# EAGLE board seamonster_buffered3 (EAGLE 9.0.1)
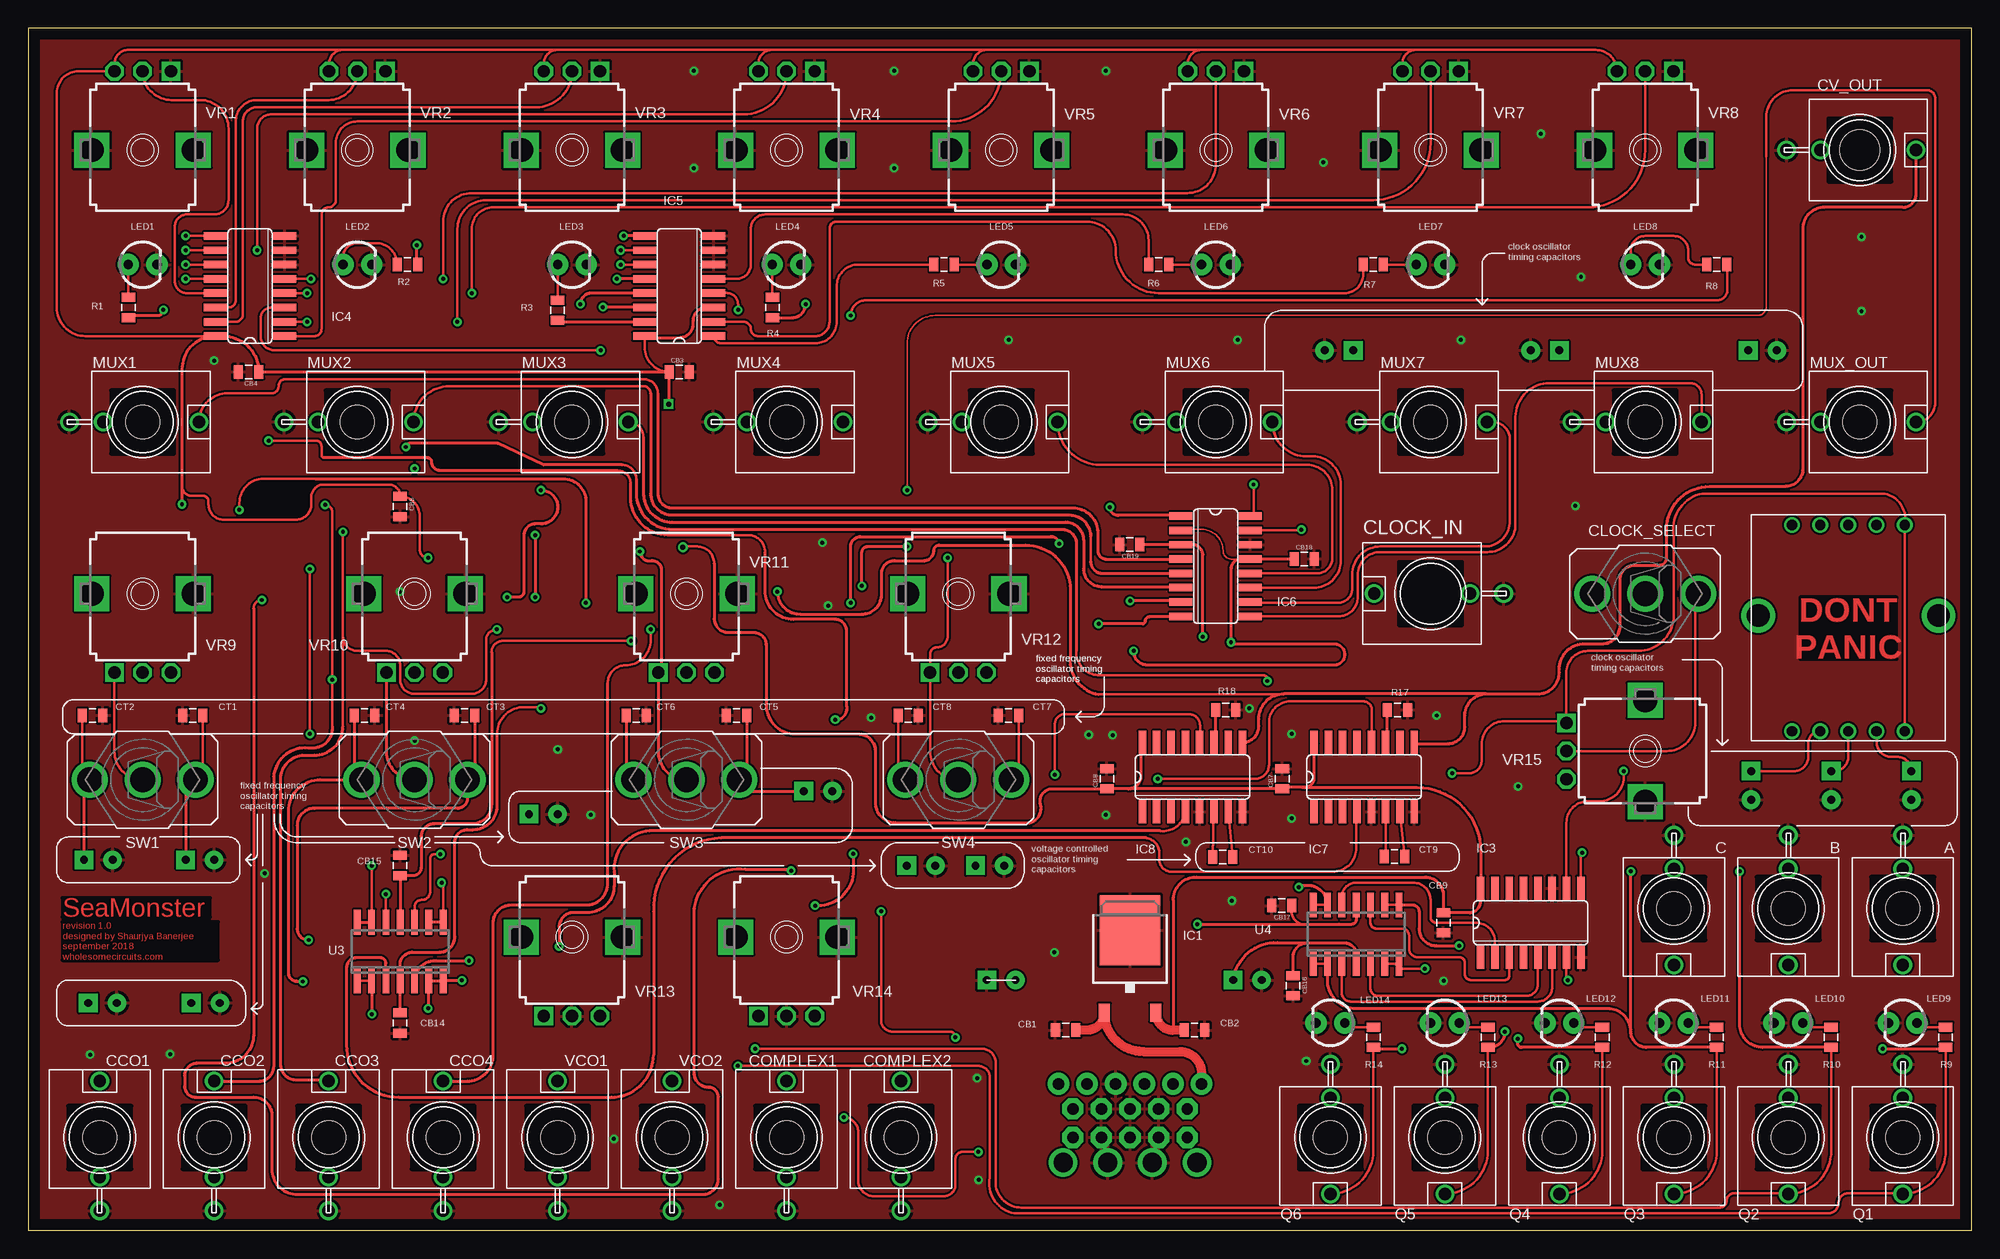
[diagram p5: board, top side]
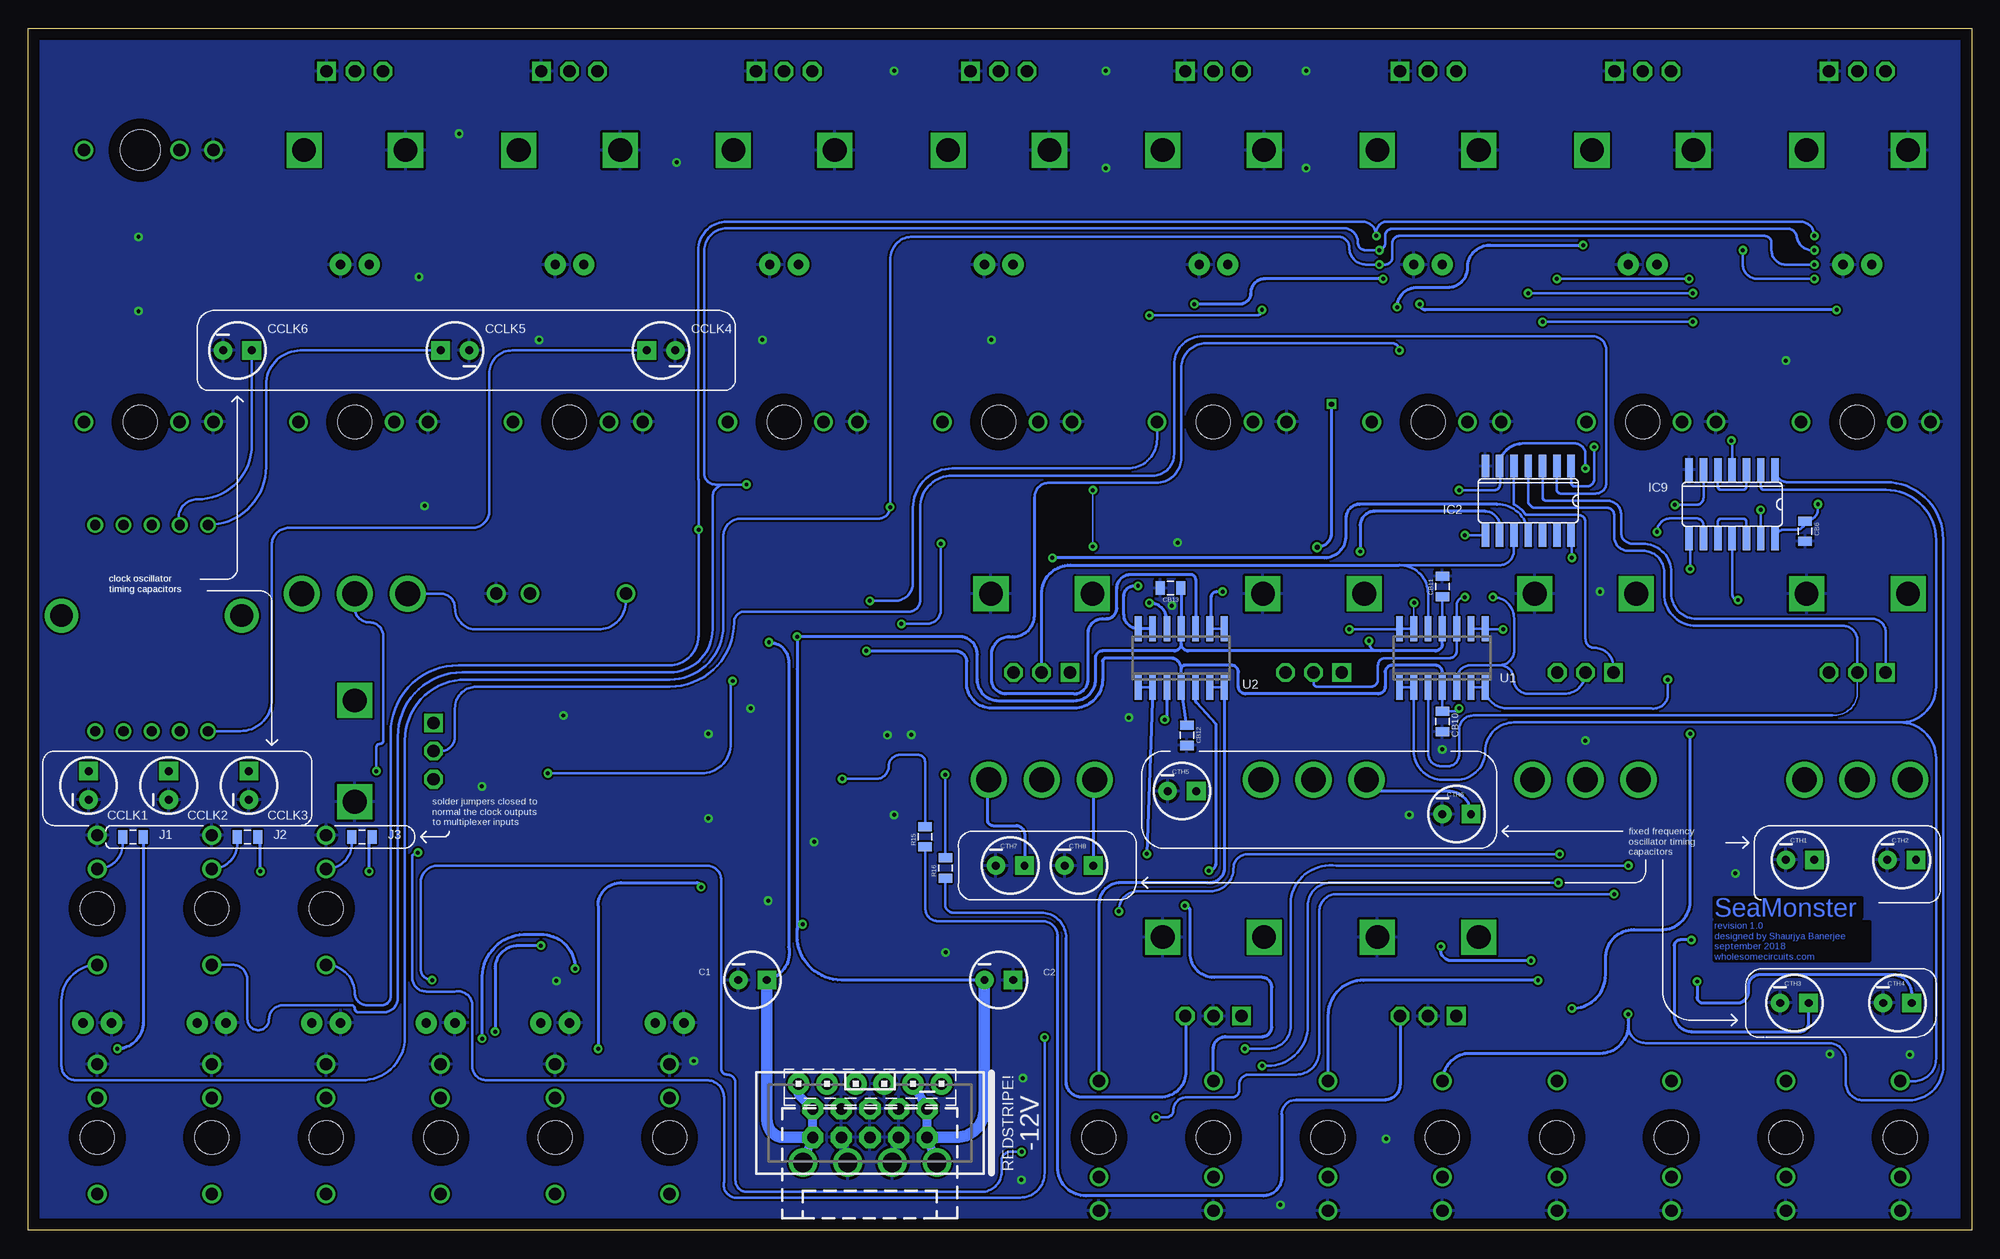
[diagram p6: board, bottom side, seen from below]

Size 172.5 x 106.7 mm. Coordinates in mm from the lower left corner, seen from the top.
Outline: 0,0 172.5,0 172.5,106.7 0,106.7 0,0
Copper layers (1*16): Top 0.035mm / dielectric 1.5mm / Bottom 0.035mm
Design rules "default": minimum track width 6mil, minimum drill 0.35mm, track to track 6mil, track to pad 6mil, pad to pad 6mil, via to via 6mil, smd to smd 6mil, copper to edge 40mil, drill to drill 6mil, minimum pad ring 10mil, minimum via ring 8mil, stop-mask expansion 4mil, vias tented up to drill 0mil, thermal gap 10mil
Holes 3 mm at 6.35,8.26 16.51,8.26 26.67,8.26 36.83,8.26 46.99,8.26 57.15,8.26 67.31,8.26 77.47,8.26 115.57,8.26 125.73,8.26 135.89,8.26 146.05,8.26 156.21,8.26 166.37,8.26 166.37,28.57 156.21,28.57 146.05,28.57 10.16,71.75 29.21,71.75 48.26,71.75 67.31,71.75 86.36,71.75 105.41,71.75 124.46,71.75 143.51,71.75 162.56,71.75
Holes 3.56 mm at 162.56,95.89

## Footprints (pad centres in the part's own frame; a part is rotated, then mirrored left to right if it is on the bottom)
WQP-PJ301M-12_JACK = drill 1.1: P$1_TIP 0,5; P$2_SWITCH 0,-3.5; P$3_SLEEVE 0,-6.5
CPOL-RADIAL-10UF-25V = drill 0.7 pad 1.651 square: 1 1.27,0 | drill 0.7 pad 1.651: 2 -1.27,0
0805 = smd 0.8 x 1.2: 1 -0.9,0; 2 0.9,0
M9040P = drill 2.2: 1 0,4.699 | drill 2.2 pad 3: 2 0,0; 3 0,-4.699
TO252 = smd 1 x 1.6: 1 -2.28,-4.8; 2 2.28,-4.8 | smd 5.4 x 6.2: 3 0,2.5
SO14 = smd 0.66 x 2.032: 1 -3.81,-3.073; 2 -2.54,-3.073; 3 -1.27,-3.073; 4 0,-3.073; 5 1.27,-3.073; 6 2.54,-3.073; 7 3.81,-3.073; 8 3.81,3.073; 9 2.54,3.073; 10 1.27,3.073; 11 0,3.073; 12 -1.27,3.073; 13 -2.54,3.073; 14 -3.81,3.073
SO16 = smd 0.66 x 2.032: 1 -4.445,-3.073; 2 -3.175,-3.073; 3 -1.905,-3.073; 4 -0.635,-3.073; 5 0.635,-3.073; 6 1.905,-3.073; 7 3.175,-3.073; 8 4.445,-3.073; 9 4.445,3.073; 10 3.175,3.073; 11 1.905,3.073; 12 0.635,3.073; 13 -0.635,3.073; 14 -1.905,3.073; 15 -3.175,3.073; 16 -4.445,3.073
LED3MM = drill 0.813 pad 1.88: A -1.27,0; K 1.27,0
SO14' = smd 0.6 x 2.2: 1 -3.81,-2.6; 2 -2.54,-2.6; 3 -1.27,-2.6; 4 0,-2.6; 5 1.27,-2.6; 6 2.54,-2.6; 7 3.81,-2.6; 8 3.81,2.6; 9 2.54,2.6; 10 1.27,2.6; 11 0,2.6; 12 -1.27,2.6; 13 -2.54,2.6; 14 -3.81,2.6
COMBO_POWER = drill 1.016 pad 1.93: +5V-DOTCOM 1.27,-3.493; COM-DOTCOM -1.27,-3.493; KEY-DOTCOM 3.81,-3.493; NA-DOTCOM -6.35,-3.493; V+DOTCOM 6.35,-3.493; V-DOTCOM -3.81,-3.493 | drill 1.016 pad 1.88 octagon: COM-EURO1 -2.54,-1.27; COM-EURO2 -2.54,1.27; COM-EURO3 0,-1.27; COM-EURO4 0,1.27; COM-EURO5 2.54,-1.27; COM-EURO6 2.54,1.27; V+EURO1 5.08,-1.27; V+EURO2 5.08,1.27; V-EURO1 -5.08,-1.27; V-EURO2 -5.08,1.27 | drill 1.7 pad 2.54: COM-MOTM1 1.98,3.493; COM_MOTM2 -1.98,3.493; V+MOTM 5.94,3.493; V-MOTM -5.94,3.493
ALPHA_SR1712F = drill 0.9: 1 5,-9.15; 2 2.5,-9.15; 3 0,-9.15; 4 -2.5,-9.15; 5 -5,-9.15; 6 -5,9.15; 7 -2.5,9.15; 8 0,9.15; 9 2.5,9.15; 10 5,9.15 | drill 2: GND@11 -8,1.1; GND@12 8,1.1
9MM_SNAP-IN_POT = drill 1.1 square: 1 -2.5,-7 | drill 1.1 octagon: 2 0,-7; 3 2.5,-7 | drill 2.1 square: CHASSIS1 -4.5,0; CHASSIS2 4.5,0

## Placement (x,y rotation side)
A  THONKICONNNEW  [WQP-PJ301M-12_JACK]  166.37,28.57 180 top
B  THONKICONNNEW  [WQP-PJ301M-12_JACK]  156.21,28.57 180 top
C  THONKICONNNEW  [WQP-PJ301M-12_JACK]  146.05,28.57 180 top
C1  47µF  [CPOL-RADIAL-10UF-25V]  108.2,22.23 0 bottom
C2  47µF  [CPOL-RADIAL-10UF-25V]  86.36,22.23 0 bottom
CB1  0.1µF  [0805]  92.08,17.78 180 top
CB2  0.1µF  [0805]  103.5,17.78 0 top
CB3  0.1µF  [0805]  57.78,76.2 0 top
CB4  0.1µF  [0805]  19.57,76.21 180 top
CB5  0.1µF  [0805]  33.02,64.26 270 top
CB6  0.1µF  [0805]  14.79,62.05 270 bottom
CB7  0.1µF  [0805]  111.3,40.08 90 top
CB8  0.1µF  [0805]  95.74,40.08 90 top
CB9  0.1µF  [0805]  125.6,27.3 270 top
CB10  0.1µF  [0805]  46.99,45.18 270 bottom
CB11  0.1µF  [0805]  46.99,57.15 90 bottom
CB12  0.1µF  [0805]  69.66,43.94 270 bottom
CB13  0.1µF  [0805]  71.12,57.02 180 bottom
CB14  0.1µF  [0805]  33.02,18.41 270 top
CB15  0.1µF  [0805]  33.02,32.38 90 top
CB16  0.1µF  [0805]  112.27,21.72 270 top
CB17  0.1µF  [0805]  111.25,28.83 180 top
CB18  0.1µF  [0805]  113.25,59.61 0 top
CB19  0.1µF  [0805]  97.76,60.88 180 top
CCLK1  [CPOL-RADIAL-10UF-25V]  167.13,39.5 90 bottom
CCLK2  [CPOL-RADIAL-10UF-25V]  160.02,39.5 90 bottom
CCLK3  [CPOL-RADIAL-10UF-25V]  152.91,39.5 90 bottom
CCLK4  [CPOL-RADIAL-10UF-25V]  116.33,78.11 180 bottom
CCLK5  [CPOL-RADIAL-10UF-25V]  134.62,78.11 180 bottom
CCLK6  [CPOL-RADIAL-10UF-25V]  153.92,78.11 0 bottom
CCO1  THONKICONNNEW  [WQP-PJ301M-12_JACK]  6.35,8.26 0 top
CCO2  THONKICONNNEW  [WQP-PJ301M-12_JACK]  16.51,8.26 0 top
CCO3  THONKICONNNEW  [WQP-PJ301M-12_JACK]  26.67,8.26 0 top
CCO4  THONKICONNNEW  [WQP-PJ301M-12_JACK]  36.83,8.26 0 top
CLOCK_IN  THONKICONNNEW  [WQP-PJ301M-12_JACK]  124.46,56.52 90 top
CLOCK_SELECT  SPDT ON-ON  [M9040P]  143.51,56.52 90 top
COMPLEX1  THONKICONNNEW  [WQP-PJ301M-12_JACK]  67.31,8.26 0 top
COMPLEX2  THONKICONNNEW  [WQP-PJ301M-12_JACK]  77.47,8.26 0 top
CT1  [0805]  14.61,45.72 180 top
CT2  [0805]  5.71,45.72 0 top
CT3  [0805]  38.73,45.72 180 top
CT4  [0805]  29.84,45.72 0 top
CT5  [0805]  62.87,45.72 180 top
CT6  [0805]  53.98,45.72 0 top
CT7  [0805]  87,45.72 180 top
CT8  [0805]  78.11,45.72 0 top
CT9  1µF  [0805]  121.27,33.17 0 top
CT10  1µF  [0805]  106.02,33.16 0 top
CTH1  [CPOL-RADIAL-10UF-25V]  15.24,32.89 0 bottom
CTH2  [CPOL-RADIAL-10UF-25V]  6.22,32.89 0 bottom
CTH3  [CPOL-RADIAL-10UF-25V]  15.75,20.19 0 bottom
CTH4  [CPOL-RADIAL-10UF-25V]  6.6,20.19 0 bottom
CTH5  [CPOL-RADIAL-10UF-25V]  70.1,38.99 0 bottom
CTH6  [CPOL-RADIAL-10UF-25V]  45.72,36.96 0 bottom
CTH7  [CPOL-RADIAL-10UF-25V]  85.34,32.38 0 bottom
CTH8  [CPOL-RADIAL-10UF-25V]  79.25,32.38 0 bottom
CV_OUT  THONKICONNNEW  [WQP-PJ301M-12_JACK]  162.56,95.89 270 top
IC1  7808DT  [TO252]  97.79,24.13 0 top
IC2  40106D  [SO14]  39.37,64.77 180 bottom
IC3  4040D  [SO16]  133.35,27.3 0 top
IC4  4051D  [SO16]  19.68,83.82 90 top
IC5  4051D  [SO16]  57.78,83.82 90 top
IC6  DG408DY  [SO16]  105.38,58.95 270 top
IC7  4046D  [SO16]  118.57,40.24 0 top
IC8  4046D  [SO16]  103.33,40.24 0 top
IC9  4070D  [SO14]  21.27,64.45 180 bottom
J1  [0805]  163.19,34.92 0 bottom
J2  [0805]  153.03,34.92 0 bottom
J3  [0805]  142.88,34.92 0 bottom
LED1  [LED3MM]  10.16,85.72 0 top
LED2  [LED3MM]  29.21,85.72 0 top
LED3  [LED3MM]  48.26,85.72 0 top
LED4  [LED3MM]  67.31,85.72 0 top
LED5  [LED3MM]  86.36,85.72 0 top
LED6  [LED3MM]  105.41,85.72 0 top
LED7  [LED3MM]  124.46,85.72 0 top
LED8  [LED3MM]  143.51,85.72 0 top
LED9  [LED3MM]  166.37,18.41 180 top
LED10  [LED3MM]  156.21,18.41 180 top
LED11  [LED3MM]  146.05,18.41 180 top
LED12  [LED3MM]  135.89,18.41 180 top
LED13  [LED3MM]  125.73,18.41 180 top
LED14  [LED3MM]  115.57,18.41 180 top
MUX1  THONKICONNNEW  [WQP-PJ301M-12_JACK]  10.16,71.75 270 top
MUX2  THONKICONNNEW  [WQP-PJ301M-12_JACK]  29.21,71.75 270 top
MUX3  THONKICONNNEW  [WQP-PJ301M-12_JACK]  48.26,71.75 270 top
MUX4  THONKICONNNEW  [WQP-PJ301M-12_JACK]  67.31,71.75 270 top
MUX5  THONKICONNNEW  [WQP-PJ301M-12_JACK]  86.36,71.75 270 top
MUX6  THONKICONNNEW  [WQP-PJ301M-12_JACK]  105.41,71.75 270 top
MUX7  THONKICONNNEW  [WQP-PJ301M-12_JACK]  124.46,71.75 270 top
MUX8  THONKICONNNEW  [WQP-PJ301M-12_JACK]  143.51,71.75 270 top
MUX_OUT  THONKICONNNEW  [WQP-PJ301M-12_JACK]  162.56,71.75 270 top
Q1  THONKICONNNEW  [WQP-PJ301M-12_JACK]  166.37,8.26 180 top
Q2  THONKICONNNEW  [WQP-PJ301M-12_JACK]  156.21,8.26 180 top
Q3  THONKICONNNEW  [WQP-PJ301M-12_JACK]  146.05,8.26 180 top
Q4  THONKICONNNEW  [WQP-PJ301M-12_JACK]  135.89,8.26 180 top
Q5  THONKICONNNEW  [WQP-PJ301M-12_JACK]  125.73,8.26 180 top
Q6  THONKICONNNEW  [WQP-PJ301M-12_JACK]  115.57,8.26 180 top
R1  270Ω  [0805]  8.89,81.91 90 top
R2  270Ω  [0805]  33.66,85.72 180 top
R3  270Ω  [0805]  46.99,81.66 90 top
R4  270Ω  [0805]  66.04,81.91 90 top
R5  270Ω  [0805]  81.28,85.72 0 top
R6  270Ω  [0805]  100.33,85.72 0 top
R7  270Ω  [0805]  119.38,85.72 0 top
R8  270Ω  [0805]  149.86,85.72 180 top
R9  270Ω  [0805]  170.18,17.15 90 top
R10  270Ω  [0805]  160.02,17.15 90 top
R11  270Ω  [0805]  149.86,17.15 90 top
R12  270Ω  [0805]  139.7,17.15 90 top
R13  270Ω  [0805]  129.54,17.15 90 top
R14  270Ω  [0805]  119.38,17.15 90 top
R15  [0805]  92.91,34.94 90 bottom
R16  [0805]  91.09,32.17 90 bottom
R17  [0805]  121.53,46.21 180 top
R18  [0805]  106.28,46.21 180 top
SW1  SPDT ON-ON  [M9040P]  10.16,40 90 top
SW2  SPDT ON-ON  [M9040P]  34.29,40 90 top
SW3  SPDT ON-ON  [M9040P]  58.42,40 90 top
SW4  SPDT ON-ON  [M9040P]  82.55,40 90 top
U1  TL084  [SO14']  46.99,50.8 0 bottom
U2  TL084  [SO14']  70.17,50.8 0 bottom
U3  TL084  [SO14']  33.02,24.77 0 top
U4  TL084D  [SO14']  117.86,26.29 0 top
U$1  COMBO_POWER  [COMBO_POWER]  97.79,9.53 180 bottom
U$2  CLOCK RATE SELECT  [ALPHA_SR1712F]  161.54,53.47 0 top
VCO1  THONKICONNNEW  [WQP-PJ301M-12_JACK]  46.99,8.26 0 top
VCO2  THONKICONNNEW  [WQP-PJ301M-12_JACK]  57.15,8.26 0 top
VR1  100KΩ  [9MM_SNAP-IN_POT]  10.16,95.89 180 top
VR2  100KΩ  [9MM_SNAP-IN_POT]  29.21,95.89 180 top
VR3  100KΩ  [9MM_SNAP-IN_POT]  48.26,95.89 180 top
VR4  100KΩ  [9MM_SNAP-IN_POT]  67.31,95.89 180 top
VR5  100KΩ  [9MM_SNAP-IN_POT]  86.36,95.89 180 top
VR6  100KΩ  [9MM_SNAP-IN_POT]  105.41,95.89 180 top
VR7  100KΩ  [9MM_SNAP-IN_POT]  124.46,95.89 180 top
VR8  100KΩ  [9MM_SNAP-IN_POT]  143.51,95.89 180 top
VR9  100KΩ  [9MM_SNAP-IN_POT]  10.16,56.52 0 top
VR10  100KΩ  [9MM_SNAP-IN_POT]  34.29,56.52 0 top
VR11  100KΩ  [9MM_SNAP-IN_POT]  58.42,56.52 0 top
VR12  100KΩ  [9MM_SNAP-IN_POT]  82.55,56.52 0 top
VR13  1MΩ  [9MM_SNAP-IN_POT]  48.26,26.03 0 top
VR14  1MΩ  [9MM_SNAP-IN_POT]  67.31,26.03 0 top
VR15  100KΩ  [9MM_SNAP-IN_POT]  143.51,42.55 270 top

## Tracks (layer width: path | path; a pad name or v marks a point on that pad's centre or on a via)
A  (via drill 0.35)
  Top 0.203: IC4.11 v13.97,85.72 | IC5.11 v52.59,85.72 | IC6.1 arc90 102.25,63.45
  Top 0.254: v96,64.2 arc90 96.75,63.45 102.25,63.45
  Bottom 0.203: v13.97,85.72 16.51,85.72 arc90 17.78,87 17.78,87.63 arc-90 18.41,88.27 50.8,88.27 arc-90 51.44,87.63 51.44,86.36 arc90 52.07,85.72 v52.59,85.72 53.77,85.72 arc90 55.25,87.2 arc-90 56.25,88.2 94,88.2 arc-90 96,86.2 v96,64.2 arc90 97.02,63.18 109.22,63.18 arc-90 110.81,61.59 110.81,56.52 110.81,53.66 arc90 115.57,48.89 115.89,48.89 123.51,48.89 133.35,48.89 133.67,48.89 arc-90 139.06,43.5 139.06,34.29 139.06,17.15 arc90 142.88,13.33 168.28,13.33 arc90 169.54,14.6 169.54,20.4 arc90 A.P$1_TIP
B  (via drill 0.35)
  Top 0.203: v13.97,87 IC4.10 | IC5.10 v52.59,87 | IC6.16 arc90 108.75,63.7 v108.75,66.2
  Bottom 0.203: v13.97,87 arc90 15.56,88.27 arc-90 16.51,88.9 51.44,88.9 arc-90 52.07,88.27 52.07,87.63 arc90 52.7,87 v52.59,87 53.79,87 arc90 54.5,87.7 arc-90 55.75,88.95 110.5,88.95 arc-90 112.5,86.95 112.5,67.2 arc-90 111.5,66.2 v108.75,66.2 | v108.75,66.2 108.5,66.2 | B.P$1_TIP 154.38,23.57 arc90 153.03,22.23 153.03,18.73 arc-90 152.08,17.78 arc-90 151.13,18.73 arc90 149.86,20 143.83,20 arc90 143.51,19.69 arc-90 143.19,19.37 140.97,19.37 arc-90 139.7,20.64 139.7,43.81 arc90 133.99,49.53 131,49.53 129.5,49.53 115.57,49.53 arc-90 111.76,53.34 111.76,65.09 arc90 110.64,66.2 v108.75,66.2
C  (via drill 0.35)
  Top 0.203: IC4.9 v13.97,88.27 | v113,62.2 arc-90 112.92,62.13 IC6.15
  Top 0.254: IC5.9 v52.84,88.27
  Bottom 0.203: v13.97,88.27 arc-90 15.24,89.53 52.07,89.53 arc-90 v52.84,88.27 arc-90 54.11,89.53 110.49,89.53 arc-90 113.03,87 113.03,66.67 arc90 113,66.64 v113,62.2 113,52.73 arc90 113.03,52.7 arc90 115.57,50.16 134.3,50.16 arc-90 140.34,44.13 140.34,20.64 arc90 141.29,20 142.24,20 arc90 143.51,20.95 143.51,21.03 arc-90 C.P$1_TIP
CCO1_BUFFERED
  Bottom 0.2: U1.1 U1.2
  Bottom 0.203: U1.2 49.53,42.55 arc-90 46.99,40 45.72,40 arc-90 43.18,42.55 arc90 40.64,45.09 6.35,45.09 | 6.35,45.09 arc-90 3.17,48.26 3.17,61.28 arc-90 7.62,65.72 18.41,65.72 arc90 18.73,66.04 IC9.2 | 6.35,45.09 arc90 3.17,41.91 3.17,15.24 arc90 5.16,13.26 CCO1.P$1_TIP
CCO2_BUFFERED  (via drill 0.35)
  Top 0.203: v26.35,64.41 arc-90 26.99,63.77 v26.99,48.89 26.99,44.72
  Top 0.254: 26.99,44.72 arc-90 25.4,42.81 24.82,42.81 arc90 21.78,40.27 21.78,14.53 arc-90 20.51,13.26 CCO2.P$1_TIP
  Bottom 0.2: U1.6 U1.7
  Bottom 0.203: U1.7 arc-90 41.34,46.35 28.57,46.35 arc-90 26.99,47.31 v26.99,48.89 | IC9.6 23.81,65.04 arc90 24.45,64.41 v26.35,64.41
CCO3_BUFFERED  (via drill 0.35)
  Top 0.203: CCO3.P$1_TIP arc90 26.59,13.33 | 27.94,44.72 27.94,52.7 | 27.94,52.7 v27.94,62 | 27.94,52.7 arc90 29.21,51.43 31.75,51.43 arc-90 33.02,50.16 33.02,48.89 arc90 34.29,47.62 39.37,47.62 arc90 40.64,48.89 40.64,52.39 arc-90 v41.59,53.34
  Top 0.254: 26.59,13.33 23.82,13.33 arc-90 22.41,14.74 22.41,39.77 arc-90 24.32,42.18 25.4,42.18 arc90 27.94,44.72
  Bottom 0.2: U1.8 U1.9
  Bottom 0.203: IC9.9 23.81,62.55 arc-90 24.47,63.2 26.73,63.2 arc-90 v27.94,62 | v41.59,53.34 43.12,53.34 arc90 U1.8
CCO4_BUFFERED  (via drill 0.35)
  Top 0.152: 24,66.7 25.5,66.7
  Top 0.203: 51.44,48.58 arc-90 53.02,50.16 arc90 55.24,52.39 v55.24,53.34 55.24,53.66 | 25.5,66.7 20.88,66.7 arc90 18.75,64.58 v18.75,63.95
  Top 0.254: CCO4.P$1_TIP 38.97,13.26 arc90 41.27,15.56 41.27,27.3 arc-90 42.86,28.89 49.53,28.89 arc90 51.44,30.8 51.44,48.58 | v49.5,55.7 49.5,64.7 arc90 47.5,66.7 25.5,66.7
  Bottom 0.152: v49.5,55.7 arc-90 49.53,55.67 U1.13
  Bottom 0.2: U1.13 U1.14
  Bottom 0.203: U1.14 arc90 50.86,53.34 v55.24,53.34 | v18.75,63.95 18.75,61.4 arc-90 IC9.13
COMPLEX_OUT1_BUFFERED  (via drill 0.35)
  Top 0.254: v69.85,28.83 arc90 73.22,31.69 v73.22,33.42
  Bottom 0.2: U2.1 U2.2
  Bottom 0.254: U2.2 v73.22,33.42 | v69.85,28.83 arc90 69.38,28.35 69.38,24.58 arc-90 67.25,22.45 63,22.45 arc90 62.12,21.58 62.12,18.08 arc90 63,17.2 66.25,17.2 arc-90 67.31,16.15 COMPLEX1.P$1_TIP
COMPLEX_OUT2_BUFFERED
  Bottom 0.2: U2.6 U2.7
  Bottom 0.254: U2.7 66.36,31.94 arc90 67.94,30.86 75.56,30.86 arc-90 77.47,28.96 COMPLEX2.P$1_TIP
CV_OUT  (via drill 0.35)
  Top 0.203: IC4.3 21.59,81.91 arc90 20.64,80.96 20.64,79.38 arc90 21.91,78.11 v50.8,78.11
  Bottom 0.203: 83.19,65.09 arc90 81.92,66.36 72.39,66.36 arc-90 70.17,68.58 70.17,76.52 arc90 67.94,78.74 51.44,78.74 arc90 v50.8,78.11
  Bottom 0.254: 83.19,65.09 83.19,54.61 arc90 85.09,52.7 85.41,52.7 arc-90 87,51.12 87,48.89 arc-90 85.72,47.62 79.69,47.62 arc-90 78.42,48.89 78.42,53.02 arc90 77.15,54.29 76.83,54.29 arc-90 75.88,55.25 75.88,56.97 arc90 74.61,58.24 69.35,58.24 arc90 68.9,57.78 U2.10
CV_OUT_BUFFERED  (via drill 0.35)
  Top 0.203: 95,47.58 111.4,47.58 arc90 111.44,47.62
  Top 0.254: IC8.9 arc90 109.22,44.76 109.22,45.4 arc-90 111.44,47.62 129.42,47.62 | 129.42,47.62 133.99,47.62 arc90 135.89,49.53 135.89,49.85 arc-90 138.11,52.07 139.7,52.07 arc90 141.29,53.66 141.29,57.78 arc-90 142.56,59.05 144.78,59.05 arc90 145.41,59.69 145.41,62.23 arc-90 149.22,66.04 155.96,66.04 arc90 157.5,67.58 157.5,88.92 arc-90 159.38,90.8 166.37,90.8 arc90 167.56,92 CV_OUT.P$1_TIP | IC7.9 arc90 123.13,43.2 126,43.2 arc90 127.5,44.7 127.5,45.7 arc-90 129.42,47.62 | v66.5,56.7 arc90 68.5,54.7 74,54.7 arc90 75.75,56.45 75.75,58.33 arc-90 76.88,59.45 79.5,59.45 arc90 80.38,60.33 arc-90 80.88,60.83 88.5,60.83 arc-90 92.5,56.83 92.5,51.08 arc90 95,47.58
  Bottom 0.2: U2.9 U2.8
  Bottom 0.203: U2.9 arc-90 67.5,53.53 | 67,56.7 v66.5,56.7
  Bottom 0.254: 67.5,53.53 67.5,56.2 arc90 67,56.7
GND  (via drill 0.35)
  Top 0.152: IC8.5
  other vias: 16.5,77.2 125,45.7 71,55.45 20.99,31.7 5.49,15.6 12.6,15.66 102.74,34.48 96.25,43.95 108.38,46.33 74.82,45.52 47,42.7 33,56.7 112.12,44.08 112.12,36.58 34.3,43.47 61.37,2.28 51.97,8.12 70.49,61.04 95.65,36.88 94.13,43.99 84.22,13.51 84.35,4.5 106.83,29.26 125.62,22.15 132.23,39.42 162.71,88.19 162.71,81.59 137.31,64.31 49.93,36.88 87.01,79.05 107.33,79.05 127.15,79.05 137.81,84.64 134.26,97.33 114.95,94.8 95.65,102.92 76.85,94.29 76.85,102.92 59.07,102.92 59.07,94.29 91.08,24.69 113.43,15.04
  pour Top (isolate 0.178): 0,0 172.72,0 172.72,107.31 0,107.31
  pour Bottom (isolate 0.178): 0,0 172.72,0 172.72,107.31 0,107.31
INV_B_IN
  Top 0.203: VR9.1 7.66,42.5 arc90 SW1.2
  Bottom 0.203: VR9.1 arc-90 7.62,49.55 7.62,53.02 arc-90 8.89,54.29 24.45,54.29 arc90 26.67,56.52 26.67,58.42 arc-90 29.21,60.96 30.16,60.96 arc90 31.11,61.91 31.11,63.5 arc-90 32.38,64.77 37.78,64.77 arc90 38.1,65.09 IC2.3
INV_B_OUT
  Bottom 0.152: VR9.2 10.16,47.62 arc90 12.38,45.72
  Bottom 0.203: VR9.2 10.16,52.39 arc-90 11.43,53.66 24.45,53.66 arc90 27.3,56.52 27.3,58.42 arc-90 29.21,60.33 30.48,60.33 arc90 31.75,61.59 31.75,63.5 arc-90 32.38,64.14 38.73,64.14 arc90 39.37,64.77 IC2.4 | 12.38,45.72 40.98,45.72 arc-90 41,45.7 44.25,45.7 arc-90 45.5,44.45 45.5,42.2 arc90 46.5,41.2 47.12,41.2 arc90 48.25,42.33 48.25,43.83 arc-90 48.26,43.84 U1.3
INV_C_IN
  Top 0.254: VR10.1 31.79,42.5 arc90 SW2.2
  Bottom 0.203: 31.75,49.55 arc90 VR10.1 31.79,49.99 arc-90 33.5,51.7 arc90 34.29,52.49 34.29,62.86 arc-90 34.92,63.5 39.58,63.5 39.92,63.91 40.33,64.25 40.64,64.43 IC2.5
INV_C_OUT  (via drill 0.35)
  Top 0.254: v45.5,65.7 arc-90 47,64.2 arc-90 45.5,62.7 45,62.7 arc90 44,61.7 44,56.7 arc-90 43.5,56.2 v42.5,56.2
  Bottom 0.203: VR10.2 arc90 36.18,47.62 39.37,47.62 arc90 40.64,48.89 arc-90 41.91,50.16 | 41.91,50.16 44.45,50.16 arc-90 45.72,48.89 U1.5 | v34.29,67.63 34.29,68.9 arc-90 35.24,69.85 39.9,69.85 | 41.91,50.16 arc-90 40.62,51.45 40.62,52.7 40.62,53.08 40.62,54.33 arc-90 v42.5,56.2 | IC2.6 arc90 41.88,67.81 41.88,66.2 arc90 42.38,65.7 v45.5,65.7
  Bottom 0.254: IC2.6 arc90 39.9,69.85
INV_D_IN  (via drill 0.35)
  Top 0.203: v54.29,60.26 54.29,60.14 | 56.2,49.85 arc90 55.92,49.57 VR11.1
  Top 0.254: VR11.1 55.92,42.5 arc90 SW3.2 | 54.29,60.14 arc90 55.24,59.44 arc-90 56.2,58.74 56.2,49.85
  Bottom 0.203: IC2.9 41.91,62.55 arc-90 43.18,63.82
  Bottom 0.254: 43.18,63.82 53.02,63.82 arc-90 54.29,62.55 v54.29,60.26
INV_D_OUT  (via drill 0.35)
  Top 0.254: v45,61.7 v45,56.2
  Bottom 0.203: VR11.2 58.42,48.58 arc-90 58.1,48.26 53.34,48.26 arc-90 52.7,48.89 52.7,50.16 arc90 52.07,50.8 46.35,50.8 arc-90 45.72,51.43 U1.10 45.72,55.48 arc90 v45,56.2 | IC2.8 arc-90 IC2.8 v45,61.7
INV_E_IN  (via drill 0.35)
  Top 0.203: SW4.2 arc-90 80.05,42.5 VR12.1 80.05,51.16 arc-90 80.64,51.75 arc90 81.6,52.7 v81.6,59.69
  Bottom 0.203: IC2.11 arc-90 42.13,64.45
  Bottom 0.254: 42.13,64.45 54.29,64.45 arc-90 55.56,63.18 55.56,61.59 arc90 57.47,59.69 v81.6,59.69
INV_E_OUT
  Bottom 0.203: U1.12 48.26,56.52 arc-90 50.8,59.05 41.91,59.05 arc-90 40.64,60.33 IC2.10 40.64,61.59
  Bottom 0.254: VR12.2 82.55,56.52 arc90 80.01,59.05 50.8,59.05
MUX1
  Top 0.203: MUX1.P$1_TIP arc-90 17.7,74.3 21.59,74.3 arc90 22.23,74.93 arc-90 22.86,75.56 54.61,75.56 arc-90 55.88,74.3
  Top 0.254: 55.88,74.3 55.88,65.41 arc90 57.15,64.14 92.71,64.14 arc-90 94.93,61.91 94.93,60.33 arc90 95.67,59.59 IC6.4
MUX2
  Top 0.203: MUX2.P$1_TIP arc-90 37.38,74.93 54.61,74.93 arc-90 55.24,74.3 | 94.3,61.59 94.3,59.37
  Top 0.254: 55.24,74.3 55.24,65.41 arc90 57.15,63.5 92.39,63.5 arc-90 94.3,61.59 | 94.3,59.37 arc90 95.35,58.32 IC6.5
MUX3
  Top 0.152: 102.21,57.15 arc-90 IC6.6
  Top 0.203: MUX3.P$1_TIP arc-90 54.61,70.41
  Top 0.254: 54.61,70.41 54.61,65.41 arc90 57.15,62.86 92.08,62.86 arc-90 93.66,61.28 93.66,58.74 arc90 95.25,57.15 102.21,57.15
MUX4  (via drill 0.35)
  Top 0.152: IC6.7 arc90 102.21,55.88
  Top 0.254: 102.21,55.88 v97.79,55.88
  Bottom 0.203: MUX4.P$1_TIP 72.31,70.25 arc90 74.93,67.63 90.49,67.63 arc-90 93.98,64.14 93.98,57.47 arc90 95.57,55.88 v97.79,55.88
MUX5
  Top 0.203: MUX5.P$1_TIP arc90 95.16,67.95 108,67.95 111,67.95 113.5,67.95 arc-90 115.75,65.7 115.75,59.7 arc-90 114.36,58.32 IC6.12
MUX6
  Top 0.203: MUX6.P$1_TIP arc90 113.46,68.7 114,68.7 arc-90 116.5,66.2 116.5,59.45 arc-90 114.09,57.05 IC6.11
MUX7
  Top 0.203: IC6.10 arc90 108.53,55.7 116.25,55.7 arc90 117.5,56.95 117.5,58.2 arc-90 120,60.7 120.5,60.7 129.25,60.7 arc90 131.5,62.95 131.5,70.2 arc90 129.95,71.75 MUX7.P$1_TIP
MUX8
  Top 0.203: IC6.9 116.31,54.51 arc90 118,56.2 118,58.2 arc-90 120,60.2 129.5,60.2 arc90 132,62.7 132,72.2 arc-90 135,75.2 147.5,75.2 arc-90 148.51,74.19 MUX8.P$1_TIP
N$1  (via drill 0.35)
  Top 0.203: IC6.8 arc-90 102.25,54.45 | v95,53.83 95,53.7
  Top 0.254: v73,55.7 73,60.7 arc-90 73.88,61.58 90.75,61.58 arc-90 v91.5,60.95 | v95,53.83 98.88,53.83 arc90 99.12,54.08 arc-90 99.5,54.45 102.25,54.45
  Bottom 0.203: v91.5,60.95 91.5,55.08 arc90 92.75,53.83 v95,53.83
  Bottom 0.254: U2.12 71.44,54.14 arc-90 v73,55.7
N$2  (via drill 0.35, 0.35 pad 0.75)
  Top 0.203: U$2.1 U$2.10 arc90 164.77,65.41 148.59,65.41 arc90 146.05,61.59 146.05,54.61 arc-90 142.88,51.43 138.43,51.43 arc90 136.51,49.52 VR15.1 arc90 136.35,45.2 131,45.2 arc90 129,43.2 129,41.7 arc-90 127.88,40.58 v126.38,40.58 | 52.7,67.94 arc-90 53.98,66.67 | 93.03,51.43 arc90 94.93,49.28 arc90 94.94,49.28 109.6,49.28 arc-90 109.98,48.89 v109.98,48.77 | v33.52,69.53 arc-90 33.84,69.85
  Top 0.254: 52.7,67.94 45.72,67.94 41.66,69.85 33.84,69.85 | 53.98,66.67 53.98,65.41 arc90 57.15,62.23 91.76,62.23 arc-90 93.03,60.96 93.03,51.43
  Bottom 0.203: IC2.1 35.56,66.36 arc-90 35.24,66.04 34.16,66.04 arc-90 33.52,66.67 v33.52,69.53 | v126.38,40.58 112.75,40.58 arc-90 110.12,43.2 110.12,48.62 arc90 v109.98,48.77
N$3
  Top 0.203: U$2.2 164.04,43.35 arc90 165.35,42.04 165.86,42.04 arc-90 CCLK1.1
N$4
  Top 0.203: U$2.3 161.54,42.04 arc-90 160.27,40.77 CCLK2.1
N$5
  Top 0.203: 159,44.28 arc-90 U$2.4 arc90 157.99,43.26 157.99,42.04 arc-90 156.72,40.77 CCLK3.1
N$6
  Top 0.203: U$2.5 arc90 156.46,44.24
  Bottom 0.203: CCLK4.1 129.54,78.11 arc-90 131.57,76.07 131.57,63.88 arc90 133.1,62.36 149.35,62.36 arc-90 150.88,60.83 150.88,47.12 arc90 153.68,44.32 U$2.5
N$7
  Bottom 0.203: CCLK5.1 148.34,78.11 arc-90 151.38,75.06 151.38,67.78 arc90 U$2.6
N$8
  Bottom 0.203: U$2.7 arc111 157.48,64.9 arc-90 152.65,69.72 CCLK6.1
N$9  (via drill 0.35)
  Top 0.152: 154.25,95.33 154.25,81.95 arc-90 153.5,81.2 80.5,81.2 arc90 78,78.7 v78,65.7
  Top 0.203: MUX_OUT.P$1_TIP arc90 169.25,73.44 169.25,100.45 arc90 168.5,101.2 156.62,101.2 arc90 154.25,98.83 154.25,95.33
  Top 0.254: v74,57.2 74,60.2 arc-90 74.5,60.7 v78,60.7
  Bottom 0.152: v78,60.7 78,65.45 arc-90 78.12,65.58 arc90 v78,65.7 | 74.38,57.2 v74,57.2
  Bottom 0.254: U2.13 U2.14 arc90 75.25,54.67 75.25,56.33 arc90 74.38,57.2
N$10
  Top 0.2: R1.2 LED1.A
N$11
  Top 0.203: LED2.A 27.94,86.36 arc-90 29.21,87.63 30.85,87.63 arc-90 R2.2
N$12
  Top 0.2: R3.2 LED3.A
N$13
  Top 0.2: R4.2 LED4.A
N$14
  Top 0.2: LED5.A R5.2
N$15
  Top 0.2: LED6.A R6.2
N$16
  Top 0.2: LED7.A R7.2
N$17
  Top 0.2: LED8.A 142.24,87 arc-90 143.51,88.27 146.05,88.27 arc-90 147.32,87 147.32,86.36 arc90 147.96,85.72 R8.2
N$18
  Top 0.203: VR1.2 arc90 12.71,100.33 15.24,100.33 arc-90 17.78,97.79 17.78,91.44 arc-90 16.51,90.17 13.97,90.17 arc90 13.02,88.9 13.02,84.45 arc90 13.97,83.19 IC4.13
N$19  (via drill 0.35)
  Top 0.254: R1.1 arc-90 9.08,81.2 11.5,81.2 arc90 v12,81.7 | IC5.13 49.98,83.19 arc90 v49,82.2
  Bottom 0.254: v49,82.2 arc-90 48.5,81.7 v12,81.7
N$20  (via drill 0.35)
  Top 0.254: R2.1 arc-90 34.5,85.78 v34.5,87.45 | IC5.14 arc90 54.67,81.95 v51,81.95
  Bottom 0.254: v51,81.95 arc90 49.25,83.7 46.5,83.7 arc-90 44.75,85.45 arc90 42.75,87.45 v34.5,87.45
N$21
  Top 0.254: R3.1 arc90 47.11,80.64 IC5.15
N$22  (via drill 0.35)
  Top 0.254: R4.1 67.81,81.02 arc90 v69,82.2 | IC5.12 v52.25,84.45
  Bottom 0.254: v52.25,84.45 62.75,84.45 arc-90 64,83.2 arc90 65,82.2 v69,82.2
N$23
  Top 0.203: R5.1 73.66,85.72 arc90 71.75,83.82 71.75,83.19 71.75,80.64 arc-90 69.85,78.74 61.49,78.74 arc-90 IC5.1
N$24
  Top 0.203: IC5.5 62.87,84.45 arc90 64.14,85.72 64.14,88.9 arc-90 65.41,90.17 97.16,90.17 arc-90 99.43,87.89 R6.1
N$25
  Top 0.203: R7.1 118.48,84.83 arc-90 116.84,83.19 100.33,83.19 arc-90 96.52,87 arc90 93.98,89.53 71.75,89.53 arc90 71.12,88.9 71.12,80.64 arc-90 69.85,79.38 64.77,79.38 arc-90 64.14,80.01 arc90 63.5,80.64 IC5.2
N$26  (via drill 0.35)
  Top 0.152: R8.1 arc-90 150.81,85.67
  Top 0.203: 150.81,85.67 150.81,83.5 arc-90 149.86,82.55 74.61,82.55 74.34,82.55 arc90 v73,81.2 | IC5.4 arc-90 60.88,83.2 62,83.2 arc-90 63,82.2 v63,81.7
  Bottom 0.203: v63,81.7 arc90 63.5,81.2 v73,81.2
N$27
  Top 0.203: VR2.2 arc-90 26.66,100.33 20.32,100.33 arc90 18.41,98.42 18.41,82.55 arc-90 17.78,81.91 IC4.14
N$28
  Top 0.203: VR3.2 arc-90 45.07,99.69 20.32,99.69 arc90 19.05,98.42 19.05,81.28 arc-90 18.41,80.64 IC4.15
N$29  (via drill 0.35)
  Top 0.203: VR4.2 arc-90 63.48,99.06 21.59,99.06 arc90 20.32,97.79 v20.32,87 | IC4.12 v13.97,84.45
  Bottom 0.203: v13.97,84.45 19.05,84.45 arc90 20.32,85.72 v20.32,87
N$30
  Top 0.203: VR5.2 arc-90 81.9,98.42 29.21,98.42 arc90 27.3,96.52 27.3,91.44 arc-90 26.67,90.8 arc90 26.04,90.17 26.04,80.01 arc-90 25.4,79.38 IC4.1
N$31  (via drill 0.35)
  Top 0.203: VR6.2 105.41,94.61 arc-90 102.87,92.08 39.37,92.08 arc90 36.83,89.53 v36.83,84.45 | IC4.5 v25.08,84.45
  Bottom 0.203: v36.83,84.45 v25.08,84.45
N$32  (via drill 0.35)
  Top 0.203: VR7.2 124.46,96.52 arc-90 119.38,91.44 40.64,91.44 arc90 38.1,88.9 v38.1,80.64 | IC4.2 v24.77,80.64
  Bottom 0.203: v38.1,80.64 v24.77,80.64
N$33  (via drill 0.35)
  Top 0.203: VR8.2 143.51,95.89 arc-90 138.43,90.8 41.27,90.8 arc90 39.37,88.9 v39.37,83.19 | IC4.4 v24.77,83.19
  Bottom 0.203: v24.77,83.19 v39.37,83.19
N$34
  Bottom 0.203: J1.1 164.09,34.35 arc90 A.P$2_SWITCH
N$35
  Bottom 0.203: IC9.5 22.54,66.04 arc-90 22.23,65.72 20.32,65.72 arc-90 20,66.04 IC9.3
N$36
  Bottom 0.203: IC9.10 22.54,62.86 arc90 22.23,63.18 20.32,63.18 arc90 20,62.86 IC9.12
N$37
  Bottom 0.203: J2.1 153.94,34.35 arc90 B.P$2_SWITCH
N$38  (via drill 0.35)
  Top 0.203: v71.63,45.34 71.88,45.34 | 65.41,60.2 arc90 63.88,61.72 56.77,61.72 | 53.47,66.29 arc90 52.32,67.44 | 26.29,68.58 arc-90 26.04,68.83 26.04,69.6 arc90 25.53,70.1 v21.34,70.1
  Top 0.254: 71.88,45.34 arc90 72.64,46.61 72.64,53.21 arc90 71.63,54.23 67.94,54.23 arc-90 65.41,56.77 65.41,60.2 | 56.77,61.72 arc-90 53.47,65.02 53.47,66.29 | 52.32,67.44 36.58,67.44 arc-90 35.81,68.2 arc90 35.43,68.58 26.29,68.58
  Bottom 0.203: 71.44,45.53 arc90 v71.63,45.34 | v21.34,70.1 arc90 21.27,70.04 IC9.4
  Bottom 0.254: U2.3 71.44,45.53
N$39  (via drill 0.35)
  Top 0.203: v20.75,55.95 arc90 20,55.2
  Top 0.254: 20,55.2 20,17.33 arc-90 17.5,14.83 15,14.83 arc90 13.88,13.71 13.88,12.83 arc90 14.88,11.83 20,11.83 arc-90 21.62,10.21 21.62,5.46 arc90 23.88,3.21 59.88,3.21 arc90 61.25,4.58 61.25,11.83 arc90 60.38,12.71 arc-90 59.12,13.96 59.12,28.58 arc-90 63.62,32.06 67.58,32.06 arc-90 v67.72,31.93
  Bottom 0.203: U2.5 arc90 68.88,48.18 | IC9.11 arc90 21.25,61.36 21.25,56.45 arc-90 v20.75,55.95
  Bottom 0.254: 68.88,48.18 arc-44 68.83,46.86 67.11,44.95 67.11,32.54 arc90 v67.72,31.93
N$40  (via drill 0.35)
  Top 0.203: IC7.12 arc90 119.25,43.36 119.25,46.2 arc90 118.5,46.95 112,46.95 arc90 110.12,45.08 110.12,41.33 arc-90 108.88,40.08 v100.25,40.08
  Bottom 0.203: v100.25,40.08 97.25,40.08 arc-90 96.12,41.2 arc90 95.12,42.2 93.5,42.2 arc90 92.91,41.61 R15.2
N$42
  Bottom 0.203: VR13.3 arc90 VR13.3 | 60,11.58 arc-90 61.25,10.33 | 81.12,26.08 arc-90 82.5,27.45 91.75,27.45 arc90 92.88,28.58 92.88,29.2 | 92.88,29.2 92.88,29.45 | 92.88,29.2 arc90 92.91,29.23 R15.1
  Bottom 0.254: VR13.3 50.75,12.96 arc90 52.12,11.58 60,11.58 | 61.25,10.33 61.25,4.71 arc90 62.88,3.08 78.62,3.08 arc90 81.12,5.58 81.12,26.08
N$43
  Top 0.203: CLOCK_SELECT.3 arc90 147.96,56.26 147.96,45.09 arc-90 145.41,42.55 VR15.2
  Bottom 0.203: VR15.2 135.89,42.55 arc-90 134.62,43.81 134.62,46.35 arc90 132.72,48.26 115.57,48.26 arc-90 109.86,53.97 arc90 108.9,54.93 94.3,54.93 arc-90 93.34,55.88 93.34,64.14 arc90 90.49,66.99 72.71,66.99 arc-90 70.8,68.9 70.8,76.83 arc90 68.26,79.38 33.7,79.38 arc90 32.43,78.11 32.43,66.36 arc90 33.38,65.41 36.51,65.41 arc90 36.83,65.72 IC2.2
N$44
  Top 0.203: IC7.6 120.47,33.28 arc-90 CT9.1
N$45
  Top 0.203: IC7.7 CT9.2
N$47
  Top 0.203: CT2.1 4.82,40.65 arc90 SW1.1
  Top 0.254: SW1.1 arc90 4.95,39.5 CTH2.1
N$48
  Top 0.203: IC8.6 CT10.1
N$49
  Top 0.203: IC8.7 CT10.2
N$50  (via drill 0.35)
  Top 0.203: IC3.10 136.53,36.2 arc-90 138.43,38.1 139.06,38.1 arc90 141.6,40 v141.6,40.77
  Bottom 0.203: CLOCK_SELECT.2 143.51,55.25 arc-90 142.24,53.97 arc90 140.97,52.7 140.97,43.5 arc90 141.29,43.18 arc-90 141.6,42.86 v141.6,40.77
N$51
  Top 0.203: LED9.A arc90 168.01,18.05 R9.2
N$52
  Top 0.203: CT1.1 15.51,40.65 arc-90 SW1.3
  Top 0.254: SW1.3 arc90 13.97,39.12 CTH1.1
N$55  (via drill 0.35)
  Top 0.254: CT4.1 28.95,40.65 arc90 SW2.1 25.91,40 arc90 23.11,37.21 23.11,22.86 arc90 23.88,22.1 v24.38,22.1
  Bottom 0.254: v24.38,22.1 24.38,20.7 arc-90 23.88,20.19 20.83,20.19 arc-90 19.81,21.21 19.81,21.72 arc90 18.8,22.73 7.11,22.73 arc90 5.33,20.95 CTH4.1
N$56  (via drill 0.35)
  Top 0.254: CT3.1 39.63,40.65 SW2.3 38.99,38.35 arc-90 38.1,37.46 25.4,37.46 arc90 23.88,35.94 23.88,26.8 arc90 v24.89,25.78
  Bottom 0.254: v24.89,25.78 25.91,25.78 arc-90 26.42,25.27 26.42,19.18 arc-90 24.89,17.65 15.24,17.65 arc-90 14.48,18.41 CTH3.1
N$59
  Top 0.254: CT6.1 53.08,40.65 arc90 SW3.1
  Bottom 0.254: CTH6.1 arc-90 46.48,38.99 52.7,38.99 arc90 SW3.1
N$60
  Top 0.254: CT5.1 63.77,40.65 arc-90 SW3.3 arc90 64.14,38.99 CTH5.1
N$61  (via drill 0.35)
  Top 0.203: U3.10 34.29,28.7 arc-90 34.92,29.34 arc90 35.69,30.1 35.69,33.02 arc-90 36.07,33.4 v36.58,33.4 | v75.69,28.32 75.69,18.67 arc90 76.71,17.65 81.79,17.65 arc-90 v82.3,17.15 | IC3.9 137.79,33.4 arc-90 v137.92,33.53
  Bottom 0.203: v75.69,28.32 75.69,28.45 arc90 74.04,30.1 67.56,30.1 arc-90 65.53,32.13 arc90 64.26,33.4 v36.58,33.4 | v82.3,17.15 82.3,5.08 arc90 84.45,2.92 109.86,2.92 arc90 110.74,4.32 110.74,11.81 arc-90 112.27,13.33 131.83,13.33 arc90 133.1,14.6 133.1,20.19 arc-90 134.62,21.21 137.16,21.21 arc90 138.43,22.48 138.43,33.15 arc90 138.18,33.4 138.05,33.4 arc-90 v137.92,33.53
N$63
  Top 0.203: CT8.1 77.2,40.65 arc90 SW4.1
  Bottom 0.203: SW4.1 arc-90 77.98,39.88
  Bottom 0.254: 77.98,39.88 CTH8.1
N$64
  Top 0.203: CT7.1 87.89,40.65 arc-90 SW4.3
  Bottom 0.203: SW4.3 arc-90 87.38,39.88
  Bottom 0.254: 87.38,39.88 87.38,36.45 arc-90 86.87,35.94 84.84,35.94 arc90 84.07,35.18 CTH7.1
N$65
  Top 0.203: LED10.A arc90 157.85,18.05 R10.2
N$66
  Top 0.203: LED11.A arc90 147.69,18.05 R11.2
N$67
  Top 0.203: LED12.A arc90 137.53,18.05 R12.2
N$68
  Top 0.203: LED13.A arc90 127.37,18.05 R13.2
N$69
  Top 0.203: LED14.A arc90 117.21,18.05 R14.2
N$70
  Bottom 0.203: CLOCK_IN.P$1_TIP 119.46,55.8 arc90 121.92,53.34 132.72,53.34 arc90 134.62,55.25 arc-90 135.89,56.52 CLOCK_SELECT.1
N$71  (via drill 0.35)
  Top 0.203: IC8.12 arc90 104,43.35 104,44.83 arc90 103,45.83 92,45.83 arc90 91.12,44.95 v91.12,40.45
  Bottom 0.203: v91.12,40.45 arc90 91.09,40.42 R16.2
N$72
  Top 0.203: 69.83,19.05 arc90 VR14.3
  Bottom 0.203: VR14.3 arc90 69.75,18.98 | 80.38,25.95 arc-90 82.62,28.2 90.38,28.2 arc90 91.12,28.95 91.12,31.24 arc90 R16.1
  Bottom 0.254: 69.75,18.98 69.75,14.08 arc90 72,11.83 79,11.83 arc90 80.38,13.21 80.38,25.95
N$74
  Top 0.254: IC8.11 arc90 105.39,43.47 R18.2
N$75
  Top 0.254: IC7.11 arc90 120.62,43.47 R17.2
N$76
  Bottom 0.203: J3.1 143.78,34.35 arc90 C.P$2_SWITCH
Q1BUFFERED  (via drill 0.35)
  Top 0.203: R9.1 170.18,16.13 170.18,7.06 arc-90 Q1.P$1_TIP arc90 166.32,3.3 161.54,3.3 arc90 160.66,2.41 arc-90 159.77,1.52 87.5,1.52 arc-90 85.34,4.7 85.34,13.59 arc90 84.33,14.6 v62.99,14.6 | 36.83,29.46 U3.8 36.83,30.73 arc90 v36.7,30.86
  Top 0.254: U3.8 U3.9 | v164.59,16.13 170.18,16.13
  Bottom 0.203: v36.7,30.86 56.9,30.86 arc-90 58.93,28.83 58.93,18.16 arc90 62.48,14.6 v62.99,14.6
  Bottom 0.254: J1.2 162.29,18.43 arc90 v164.59,16.13 164.08,16.13
Q2  (via drill 0.35)
  Top 0.203: U3.12 v31.75,29.84 | IC3.7 136.53,22.35 arc90 v136.65,22.23 | v72.39,10.03 arc-90 73.66,8.76 73.66,4.45 arc90 75.06,3.05 81.28,3.05 arc90 82.3,4.06 82.3,6.35 arc-90 82.93,6.99 v84.33,6.99
  Bottom 0.203: v31.75,29.84 56.39,29.84 arc-90 57.91,28.32 57.91,15.88 arc90 59.94,13.84 64.14,13.84 arc-90 65.02,12.95 65.02,12.45 arc90 65.66,11.81 69.72,11.81 arc-90 70.87,10.67 arc90 71.5,10.03 v72.39,10.03 | v136.65,22.23 arc90 137.67,23.24 137.67,30.86 arc90 136.14,32.38 112.27,32.38 arc90 111,31.11 111,14.35 arc-90 110.49,13.84 arc90 109.73,13.08 109.73,4.45 arc-90 108.71,3.43 87.88,3.43 arc-90 86.11,5.21 86.11,6.22 arc90 85.34,6.99 v84.33,6.99
Q2BUFFERED  (via drill 0.35)
  Top 0.203: R10.1 160.02,7.06 arc-90 Q2.P$1_TIP arc90 156.16,3.3 151.38,3.3 arc90 150.75,2.67 arc-90 150.11,2.03 88.14,2.03 arc-90 85.85,4.32 85.85,14.6 arc90 84.84,16.13 v64.52,16.13 | U3.13 v30.48,32.38
  Top 0.254: U3.14 U3.13 | R10.1 arc90 160.01,16.26 153.92,16.26 arc-90 151.89,18.29 v151.89,31.88
  Bottom 0.203: v30.48,32.38 56.39,32.38 arc-90 60.45,29.34 60.45,18.16 arc90 62.48,16.13 v64.52,16.13
  Bottom 0.254: v151.89,31.88 151.89,34.68 arc-90 J2.2
Q3
  Top 0.203: IC3.6 135.25,21.59 arc-90 133.99,20.32 117.35,20.32 arc-90 116.59,21.08 U4.3
Q3BUFFERED  (via drill 0.35)
  Top 0.203: U4.2 U4.1 | Q3.P$1_TIP arc90 149.86,7.06 R11.1
  Top 0.254: 142.24,17.65 v142.24,31.88 | 142.24,17.65 arc90 140.21,19.69 117.86,19.69 arc-90 115.32,22.23 U4.2 | 142.24,17.65 arc90 143.65,16.24 R11.1
  Bottom 0.254: v142.24,31.88 142.24,34.66 arc90 J3.2
Q4
  Top 0.203: IC3.5 133.99,21.84 arc-90 132.97,20.83 119.76,20.83 arc-90 119.13,21.46 U4.5
Q4BUFFERED  (via drill 0.35)
  Top 0.203: U4.7 121.41,23.69 | 121.41,23.69 U4.6 | Q4.P$1_TIP arc90 139.7,7.06 R12.1 | v123.95,23.24 121.86,23.24 arc-90 121.41,23.69
  Top 0.254: R12.1 132.6,16.24 arc-90 132.21,16.51 v132.21,17.02
  Bottom 0.254: v132.21,17.02 132.21,22.23 arc90 128.52,26.29 127,26.29 arc90 v123.95,23.24
Q5
  Top 0.203: U4.10 119.13,27.3 arc90 119.63,26.8 121.92,26.8 arc-90 122.56,26.16 122.56,25.02 arc90 123.32,24.26 127,24.26 arc-90 127.51,23.75 127.51,22.73 arc90 128.02,22.23 131.06,22.23 arc90 131.44,22.61 IC3.3 arc-90 131.57,24.1
Q5BUFFERED  (via drill 0.35)
  Top 0.203: U4.9 U4.8 | Q5.P$1_TIP arc90 129.54,7.06 R13.1
  Top 0.254: U4.8 122.88,28.89 arc-90 123.44,28.32 123.44,26.8 arc90 124.97,25.27 v127,25.27 | v131.06,17.65 arc-90 129.66,16.24 R13.1
  Bottom 0.254: v127,25.27 129.03,25.27 arc-90 131.06,23.24 v131.06,17.65
Q6
  Top 0.203: IC3.2 130.18,25.65 arc90 128.52,27.3 124.97,27.3 arc-90 124.46,27.81 124.46,29.34 arc90 122.94,30.86 117.86,30.86 arc90 116.59,29.59 U4.12
Q6BUFFERED  (via drill 0.35)
  Top 0.203: U4.14 U4.13 | Q6.P$1_TIP arc90 119.38,7.06 R14.1
  Top 0.254: R14.1 arc90 119.5,16.13 v121.92,16.13 | U4.13 arc90 113.6,30.61 112.9,30.61 arc90 v112.78,30.48
  Bottom 0.254: v121.92,16.13 121.92,28.83 arc90 119.89,30.86 113.16,30.86 arc90 v112.78,30.48
V+  (via drill 0.35)
  Top 0.152: IC6.2 arc-90 102.41,62.23 104.14,62.23 arc-90 106.05,60.33 arc90 106.78,59.59 107.64,59.59
  Top 0.203: U3.4 arc-90 33,22.18 | 41.62,44.08 arc-90 44,46.45 45.25,46.45 arc90 45.38,46.33 v45.5,46.33 | 117.86,24.51 U4.4
  Top 0.254: CB18.1 108.47,59.61 arc90 IC6.13 107.64,59.59 arc90 106.75,58.7 v106.75,52.2 arc90 106.89,52.07 115.89,52.07 arc-90 116.84,51.12 arc-90 115.89,50.16 99.38,50.16 arc-90 v98.11,51.43 | CB14.1 U3.4 | 33,22.18 33,23.58 arc-90 34.12,24.7 36.5,24.7 arc90 37.88,26.08 37.88,34.45 arc-90 39,35.58 39.5,35.58 arc90 41.62,37.7 41.62,44.08 | C1.1 arc-90 111.25,25.53 113.54,25.53 | 117.86,24.51 arc90 116.84,25.53 113.54,25.53 | CB16.1 112.27,24.26 arc-90 113.54,25.53
  Top 0.813: U$1.V+DOTCOM 104.14,13.97 arc90 102.23,15.88 98.97,15.88 arc-90 IC1.1 arc-90 93.96,17.78 CB1.1
  Bottom 0.203: U1.4 CB10.1 45.75,46.08 arc-90 v45.5,46.33
  Bottom 0.254: C1.1 arc-90 105,25.17 105,50.45 arc-90 v106.75,52.2 | U1.4 46.99,49.53 arc-90 47.62,50.16 51.44,50.16 arc-90 52.07,49.53 52.07,48.26 arc90 52.7,47.62 64.45,47.62 arc90 65.09,48.26 65.09,49.53 arc-90 65.72,50.16 69.85,50.16 arc-90 70.17,49.85 | 70.17,49.85 U2.4 CB12.1 | 70.17,49.85 arc-90 71.12,50.8 76.83,50.8 arc-90 77.15,50.48 77.15,48.89 arc90 79.69,46.35 87,46.35 arc90 89.22,48.58 89.22,50.48 arc-90 90.17,51.43 v98.11,51.43
  Bottom 0.813: U$1.V+DOTCOM 104.14,12.06 U$1.V+EURO1 U$1.V+EURO2 U$1.V+MOTM
  Bottom 1.016: U$1.V+EURO2 105.41,8.26 arc90 106.93,9.78 C1.1
V-  (via drill 0.35)
  Top 0.203: 41.12,51.33 arc-90 42.12,52.33 v53.5,52.33 | 116.33,27.18 113.02,27.18 arc-90 CB17.1
  Top 0.254: v104.25,52.7 104.25,59.95 arc90 103.34,60.86 IC6.3 arc90 102.29,60.88 CB19.1 | U3.11 CB15.1 34.16,31.48 arc90 34.88,32.2 34.88,34.95 arc-90 36,36.08 39.38,36.08 arc90 41.12,37.83 41.12,51.33 | U4.11 117.86,27.56 arc-90 117.47,27.18 116.33,27.18 v103.76,27.18
  Bottom 0.203: U1.11 CB11.1 | 104.25,48.69 104.25,49.85 | 52.5,51.43 52.73,51.43 arc90 53.5,52.2 v53.5,52.33
  Bottom 0.254: C2.2 100.33,22.23 arc90 104.25,26.14 104.25,26.69 | 104.25,26.69 104.25,49.85 v104.25,52.7 89.85,52.7 arc90 88.27,51.12 88.27,48.89 arc-90 86.36,46.99 79.69,46.99 arc-90 77.79,48.89 77.79,50.8 arc90 77.15,51.43 70.8,51.43 arc-90 70.17,52.07 | U1.11 46.99,52.07 arc90 47.62,51.43 52.5,51.43 69.53,51.43 arc90 70.17,52.07 | 70.17,52.07 U2.11 70.17,56.46 arc-90 CB13.1 | 104.25,26.69 arc90 v103.76,27.18
  Bottom 0.813: U$1.V-DOTCOM U$1.V-EURO1 U$1.V-EURO2 U$1.V-MOTM
  Bottom 1.016: C2.2 87.63,10.79 arc90 90.17,8.26 U$1.V-EURO2
VCC  (via drill 0.35, 0.45)
  Top 0.2: VR1.3 7.66,103.55 arc-90 8.89,104.77 27.94,104.77 | 46.99,104.77 27.94,104.77 | 66.04,104.77 46.99,104.77 | 85.09,104.77 66.04,104.77 | 104.14,104.77 85.09,104.77 | 123.19,104.77 104.14,104.77 | 123.19,104.77 139.12,104.77 arc-90 VR8.3 | VR2.3 26.71,103.55 arc-90 27.94,104.77 | VR3.3 45.76,103.55 arc-90 46.99,104.77 | VR4.3 64.81,103.55 arc-90 66.04,104.77 | VR5.3 83.86,103.55 arc-90 85.09,104.77 | VR6.3 102.91,103.55 arc-90 104.14,104.77 | VR7.3 121.96,103.55 arc-90 123.19,104.77
  Top 0.203: CB3.1 arc-90 54.71,78.37 IC5.16 | IC4.16 5.08,79.38 arc-90 2.54,81.91 2.54,100.97 arc-90 4.45,102.87 7.64,102.87 arc90 VR1.3 | 128.91,29.21 IC3.16 | v58.1,60.64 arc-90 58.16,60.7 59.38,60.7 arc-90 60.88,59.2 | 113,39.37 arc90 113.04,39.33 | v35.5,59.7 arc-90 34.75,60.45 34.75,63.43 arc90 CB5.1 33.02,65.19 arc90 32,66.2 26.25,66.2 arc90 25.12,65.08 25.12,64.45 arc-90 23.75,63.08 17.36,63.08 arc-90 16,64.44 16,64.7 arc90 15.5,65.2 14.5,65.2 arc-90 13.65,66.05 13.65,67.7 | CB2.1 arc90 101.6,17.79
  Top 0.254: 128.91,29.21 arc-90 127.9,28.2 CB9.1 125.6,29.72 arc90 123.95,31.37 103.67,31.37 arc90 101.62,29.32 | 114.35,43.2 114.24,43.2 arc-90 IC7.16 114.12,40.15 arc-90 113.35,39.37 113,39.37 111.49,39.37 arc90 CB7.1 97.6,39.18 | 98.85,43.35 arc90 IC8.16 98.89,42.74 arc90 98.74,42.6 98.74,40.32 arc-90 97.6,39.18 | IC5.3 60.21,81.91 arc90 59,80.7 59,80.45 arc-90 57.75,79.2 54.88,79.2 arc-90 IC5.16 | v13.65,64.45 13.65,67.7 13.65,76.42 arc-90 IC4.16 17.3,79.38 arc-90 CB4.1 CB3.1 arc-90 CB3.1 56.88,73.39 arc-90 v56.83,73.34 | 97.6,39.18 CB8.1 90.62,39.18 arc90 89.85,37.78 arc-90 88.9,36.2 76.96,36.2 arc-90 75.18,37.97 75.18,42.55 arc90 73.66,44.07 68.07,44.07 arc-90 65.5,46.64 65.5,51.95 arc90 64.38,53.08 62.12,53.08 arc-90 60.88,54.33 60.88,59.2 | 113.04,39.33 123.25,39.33 arc-90 128.91,33.67 IC3.16 | 101.6,29.34 arc-90 101.62,29.32 | 101.62,29.32 101.62,17.78
  Top 0.813: IC1.2 arc90 101.62,17.78 CB2.1
  Bottom 0.203: v35.5,59.7 35.5,61.64 arc-90 IC2.14 | v13.65,64.45 13.65,64.08 arc90 CB6.1 arc90 15.53,62.2 16.64,62.2 arc-90 IC9.14
  Bottom 0.254: v56.83,73.34 56.83,61.91 arc90 v58.1,60.64
VCO1_OUT
  Top 0.203: IC7.4 arc-90 118,37.11 arc90 117.88,36.98 117.88,33.95 arc-90 115.75,31.83 101.5,31.83 arc-90 100.38,32.95 100.38,33.2 arc90 99.25,34.84
  Top 0.254: 99.25,34.84 61.5,34.84 arc90 55.5,28.33 55.5,15.58 arc-90 51.75,11.83 32.88,11.83 arc-90 28.25,16.45 28.25,23.33 arc-90 29.12,24.2 31.25,24.2 arc-90 31.75,23.7 U3.3
VCO1_OUT_BUFFERED  (via drill 0.35)
  Top 0.2: U3.1 U3.2
  Top 0.203: U3.2 arc-90 30.5,22.14
  Top 0.254: 30.5,22.14 v30.5,19.2
  Bottom 0.203: IC9.1 arc-90 16.36,66.42 7.62,66.42 arc90 2.54,61.34 2.54,14.6 arc90 5.59,11.56 9.65,11.56 arc90 11.18,13.08 11.18,15.11 arc-90 12.7,16.64 28.96,16.64 arc90 30.5,18.18 30.5,18.67
  Bottom 0.254: v30.5,19.2 30.5,18.67 30.5,18.2 arc90 33,15.71 44.54,15.71 arc-90 VCO1.P$1_TIP
VCO2_OUT  (via drill 0.35)
  Top 0.203: IC8.4 arc-90 100.48,35.46
  Top 0.254: 100.48,35.46 55.12,35.46 arc90 52,31.83 52,30.58 arc-90 49.62,28.2 48.38,28.2 arc90 47.12,26.95 v47.12,25.2 | U3.5 arc-90 36.2,23.95 v39.12,23.95
  Bottom 0.254: v39.12,23.95 46.38,23.95 arc90 v47.12,25.2
VCO2_OUT_BUFFERED  (via drill 0.35)
  Top 0.203: U3.7 arc-90 36.87,22.2 | v25,58.7 v25,44.08 | U3.6 arc90 35.5,22.1
  Top 0.254: U3.6 U3.7 | 36.87,22.2 v38.5,22.2 | 35.5,22.1 v35.5,19.7
  Bottom 0.203: IC9.8 arc90 25,61.3 v25,58.7
  Bottom 0.254: VCO2.P$1_TIP 57.15,19.05 arc90 54,22.2 v38.5,22.2 | v35.5,19.7 arc-90 32.5,22.7 32.5,24.2 arc90 30,26.7 27.5,26.7 arc-90 25,29.2 v25,44.08

## Text on the board
Top: DONT / PANIC | SeaMonster | revision 1.0 / designed by Shaurjya Banerjee / september 2018 / wholesomecircuits.com
Bottom: SeaMonster | revision 1.0 / designed by Shaurjya Banerjee / september 2018 / wholesomecircuits.com
tPlace: clock oscillator / timing capacitors | clock oscillator / timing capacitors | fixed frequency / oscillator timing / capacitors | fixed frequency / oscillator timing / capacitors | fixed frequency / oscillator timing / capacitors | voltage controlled / oscillator timing / capacitors
bPlace: clock oscillator / timing capacitors | clock oscillator / timing capacitors | solder jumpers closed to / normal the clock outputs / to multiplexer inputs | fixed frequency / oscillator timing / capacitors
tStop: DONT / PANIC | SeaMonster | revision 1.0 / designed by Shaurjya Banerjee / september 2018 / wholesomecircuits.com
bStop: SeaMonster | revision 1.0 / designed by Shaurjya Banerjee / september 2018 / wholesomecircuits.com